# EAGLE design NanoConnectionBoard (EAGLE 9.0.1)
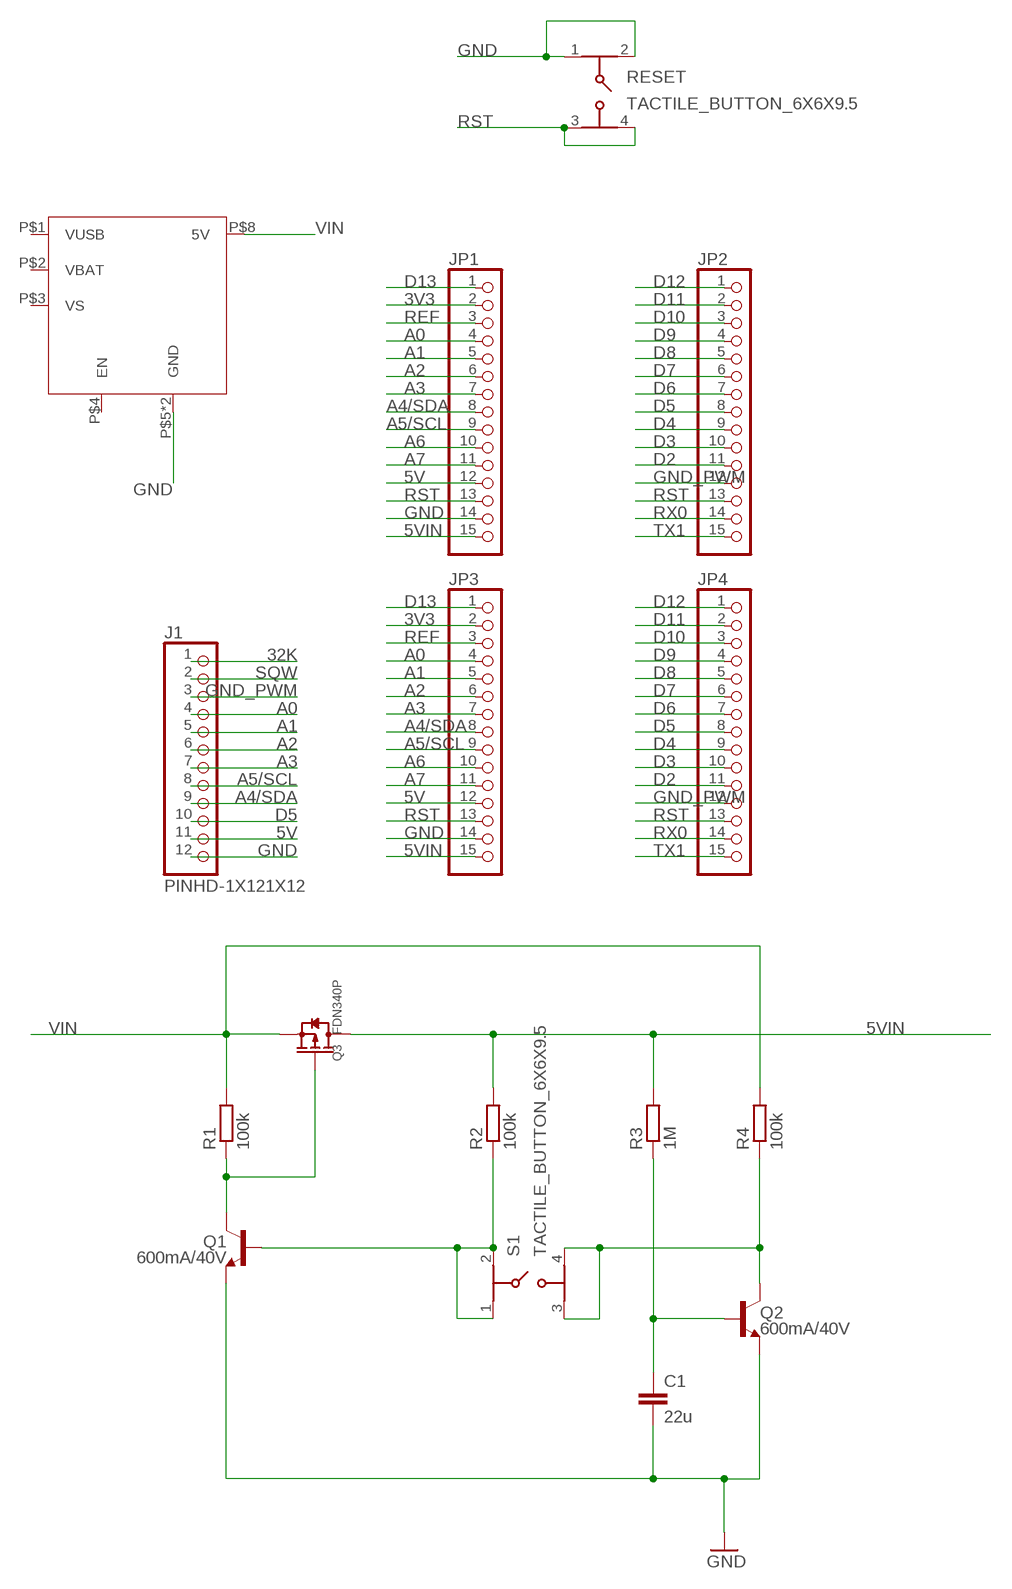
[diagram p0: schematic, sheet 1]

## Parts
C1  22u  C-EUC1210K  [C1210K]
J1  PINHD-1X121X12  [1X12]
JP1  PINHD-1X15-CB  [1X15-CB]
JP2  PINHD-1X15-CB  [1X15-CB]
JP3  PINHD-1X15-CB  [1X15-CB]
JP4  PINHD-1X15-CB  [1X15-CB]
Q1  600mA/40V  TRANS_NPN-P2N2222A  [TO-92]
Q2  600mA/40V  TRANS_NPN-P2N2222A  [TO-92]
Q3  FDN340P  SMD-MOSFET-P-CH-20V-2A-FDN340P(SOT-23)  [SOT-23]
R1  100k  R-EU_R0603  [R0603]
R2  100k  R-EU_R0603  [R0603]
R3  1M  R-EU_R0603  [R0603]
R4  100k  R-EU_R0603  [R0603]
RESET  TACTILE_BUTTON_6X6X9.5  [TACTILE_SWITCH_PTH_6.0MM]
S1  TACTILE_BUTTON_6X6X9.5  [TACTILE_SWITCH_PTH_6.0MM]
U$1  ADAFRUIT_POWERBOOST_1000C  [ADAFRUIT_POWERBOOST_1000C]

## Nets
3V3: JP1.2 JP3.2
5V: J1.11 JP1.12 JP3.12
5VIN: JP1.15 JP3.15 Q3.3(D) R2.2 R3.2
32K [Signal]: J1.1
A0 [Signal]: J1.4 JP1.4 JP3.4
A1 [Signal]: J1.5 JP1.5 JP3.5
A2 [Signal]: J1.6 JP1.6 JP3.6
A3: J1.7 JP1.7 JP3.7
A4/SDA: J1.9 JP1.8 JP3.8
A5/SCL: J1.8 JP1.9 JP3.9
A6: JP1.10 JP3.10
A7: JP1.11 JP3.11
D2: JP2.11 JP4.11
D3: JP2.10 JP4.10
D4: JP2.9 JP4.9
D5: J1.10 JP2.8 JP4.8
D6: JP2.7 JP4.7
D7: JP2.6 JP4.6
D8: JP2.5 JP4.5
D9: JP2.4 JP4.4
D10: JP2.3 JP4.3
D11: JP2.2 JP4.2
D12: JP2.1 JP4.1
D13: JP1.1 JP3.1
GND: C1.2 J1.12 JP1.14 JP3.14 Q1.3(E) Q2.3(E) RESET.1 RESET.2 U$1.P$5(GND) U$1.P$7(GND)
GND_PWM: J1.3 JP2.12 JP4.12
N$1: C1.1 Q2.2(B) R3.1
N$2: Q2.1(C) R4.1 S1.3 S1.4
N$3: Q1.1(C) Q3.1(G) R1.1
N$6: Q1.2(B) R2.1 S1.1 S1.2
REF: JP1.3 JP3.3
RST: JP1.13 JP2.13 JP3.13 JP4.13 RESET.3 RESET.4
RX0: JP2.14 JP4.14
SQW [Signal]: J1.2
TX1: JP2.15 JP4.15
VIN: Q3.2(S) R1.2 R4.2 U$1.P$8(5V)
Unconnected: U$1.P$4(EN)

## Power pins joined to a net without a drawn wire
VBAT: U$1.P$2(VBAT)
VS: U$1.P$3(VS)
VUSB: U$1.P$1(VUSB)

## Library data of the parts
C1 = resistor:C-EU: CAPACITOR, European symbol
J1 = Pat Sonstiges:PINHD-1X12
JP1-JP4 = adafruit:PINHD-1X15: PIN HEADER
Q1 Q2 = SparkFun-DiscreteSemi:TRANS_NPN: NPN transistor Current controlled devices typically used to amplify current or used as a switch. BC547 - COM-08928 <http://www.sparkfun.com/products/8928> (TO-92 45V 100mA) (1.Collector 2.Base 3.Emitter) 2N3904 - COM-00521 <http://www.sparkfun.com/products/521> (TO-92 40V 200mA) (1.Emitter 2.Base 3.Collector) P2N2222A - COM-12852 <http://www.sparkfun.com/products/12852> (TO-92 40V 600mA) (1.Collector 2.Base 3.Emitter); PROD_ID: TRANS-09536
Q3 = Seeed-Transistor:SMD-MOSFET-P-CH-20V-2A-FDN340P(SOT-23): 305030026; MPN: FDN340P
R1-R4 = rcl:R-EU_: RESISTOR, European symbol; SPICEPREFIX: R
RESET S1 = Pat Sonstiges:TACTILE_BUTTON_6X6X9.5
U$1 = My Breakout Boards:ADAFRUIT_POWERBOOST_1000C

## Net classes
0 default: width 0.254 mm, drill 0.8 mm, clearance 0.203 mm
1 Signal: width 0.254 mm, drill 0.8 mm, clearance 0.203 mm to class 0, clearance 0.203 mm

## Board
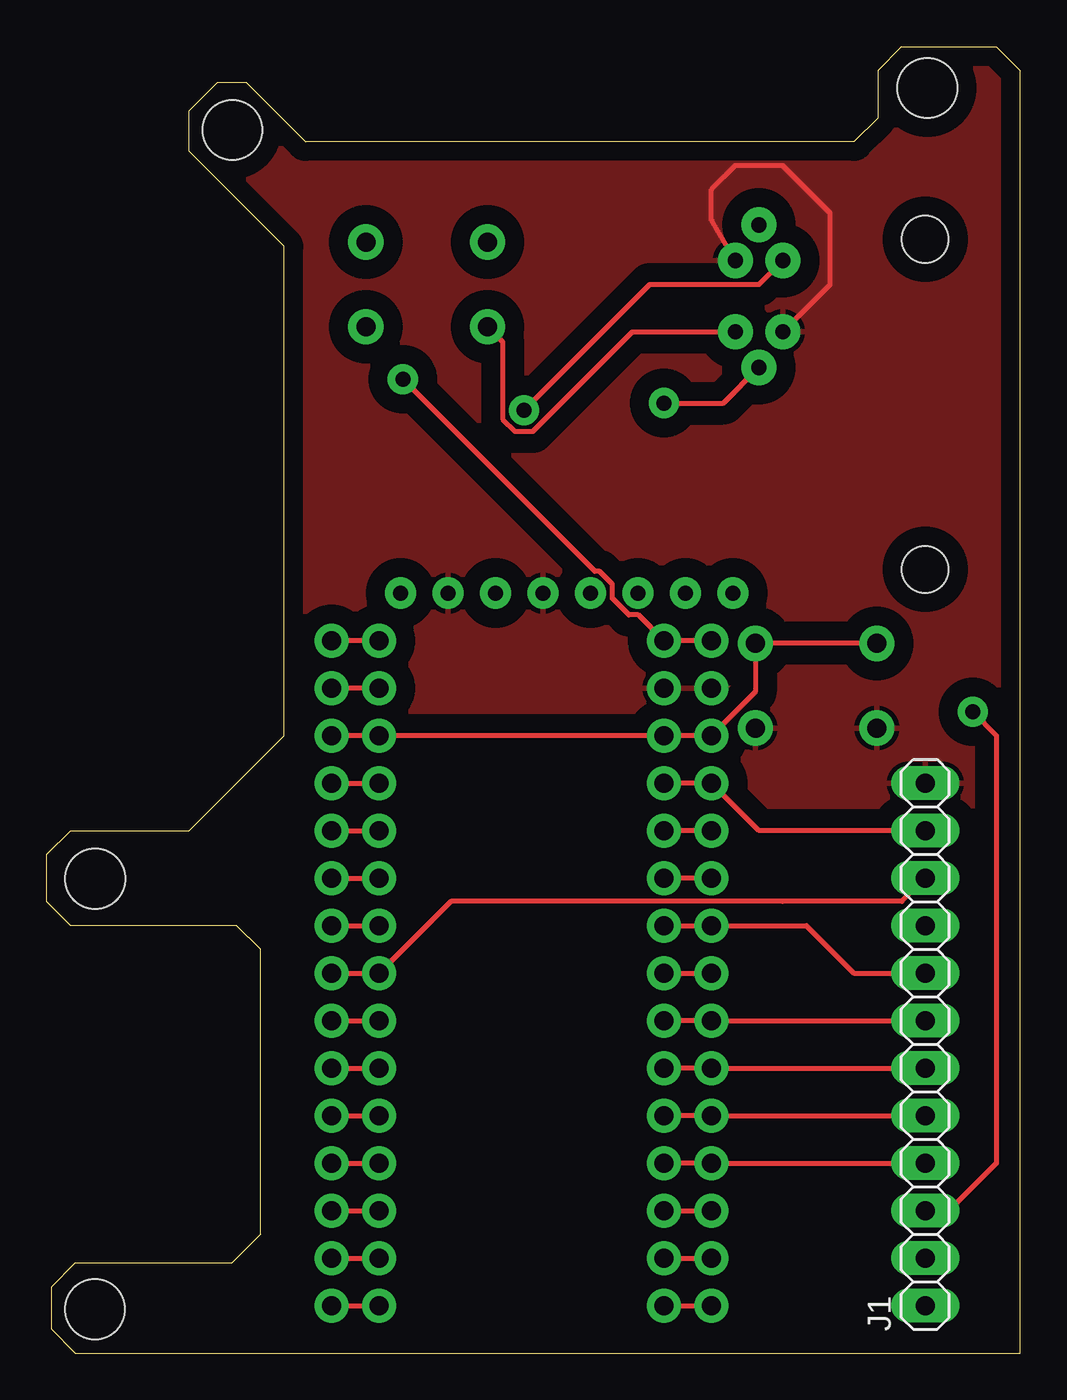
[diagram p1: board, top side]
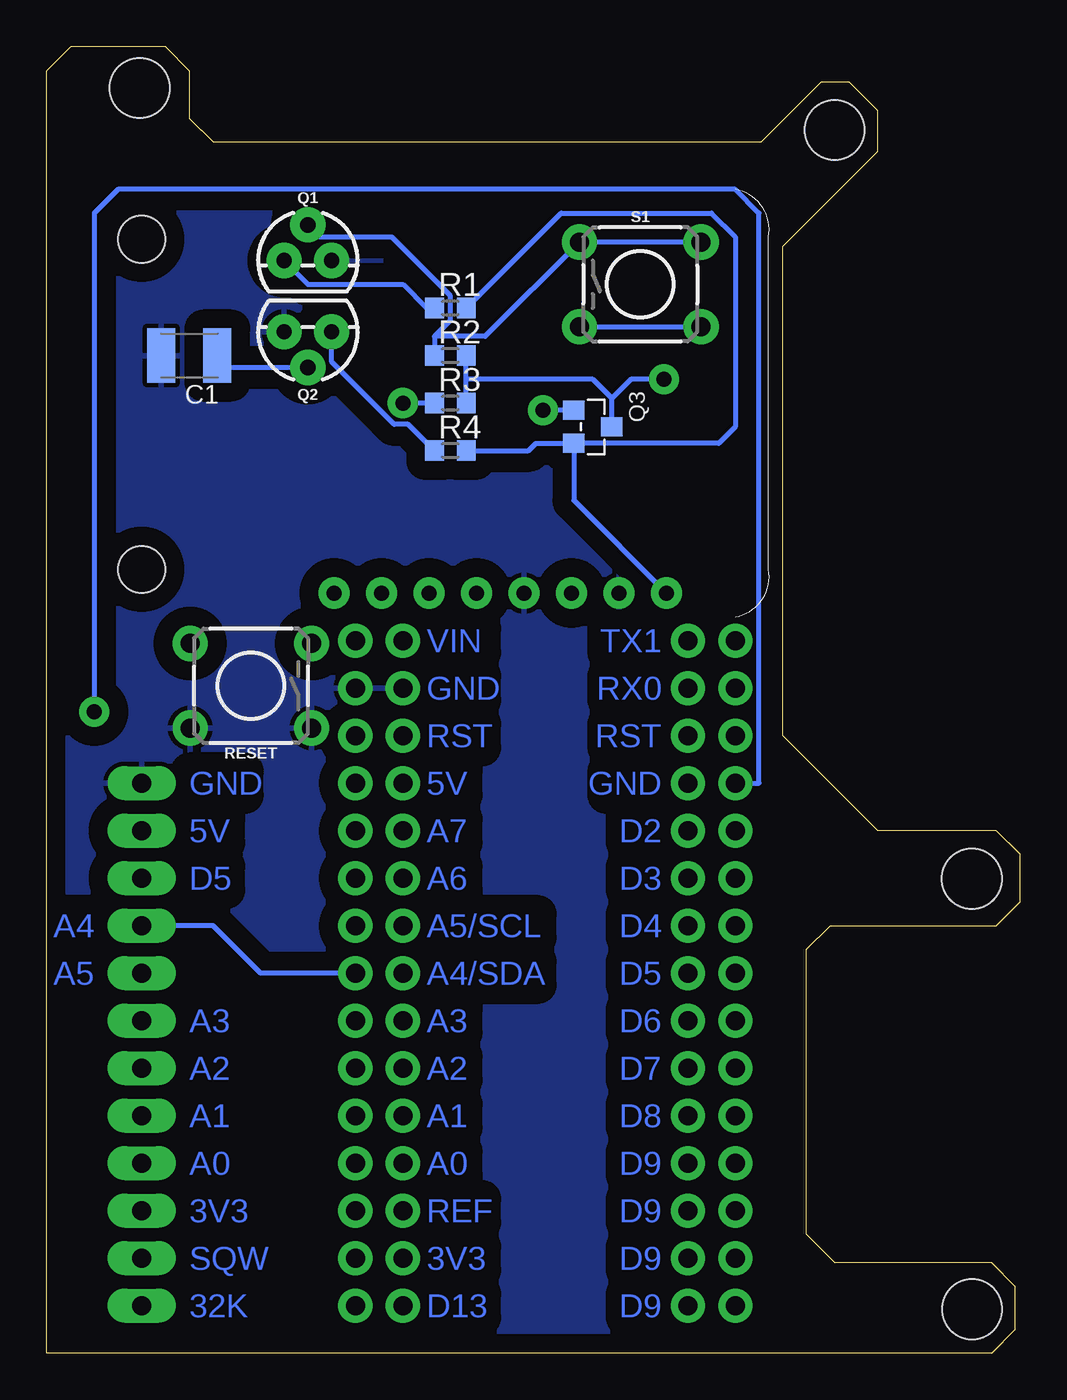
[diagram p2: board, bottom side, seen from below]

Size 52.07 x 69.85 mm. Coordinates in mm from the lower left corner, seen from the top.
Outline: 1.52,0 52.07,0 52.07,68.58 50.8,69.85 45.72,69.85 44.45,68.58 44.45,66.04 43.18,64.77 13.84,64.77 10.67,67.94 9.14,67.94 7.62,66.42 7.62,64.26 12.7,59.18 12.7,33.02 7.62,27.94 1.27,27.94 0,26.67 0,24.13 1.27,22.86 10.16,22.86 11.43,21.59 11.43,6.35 9.91,4.83 1.52,4.83 0.25,3.56 0.25,1.27 1.52,0
Copper layers (1*16): Top 0.035mm / dielectric 1.5mm / Bottom 0.035mm
Design rules "MakerSpace": minimum track width 8mil, minimum drill 0.6mm, track to track 8mil, track to pad 8mil, pad to pad 8mil, via to via 8mil, smd to smd 8mil, copper to edge 40mil, drill to drill 10mil, minimum pad ring 16mil, minimum via ring 16mil, stop-mask expansion 4mil, vias tented up to drill 0mil, thermal gap 10mil
Holes 3.2 mm at 47.1,67.64 9.93,65.41 2.59,25.37 2.58,2.36

### Footprints (pad centres in the part's own frame; a part is rotated, then mirrored left to right if it is on the bottom)
C1210K = smd 1.5 x 2.9: 1 -1.5,0; 2 1.5,0
1X12 = drill 1.016 long: 1 -13.97,0; 2 -11.43,0; 3 -8.89,0; 4 -6.35,0; 5 -3.81,0; 6 -1.27,0; 7 1.27,0; 8 3.81,0; 9 6.35,0; 10 8.89,0; 11 11.43,0; 12 13.97,0
1X15-CB = drill 1.016 pad 1.778: 1 -17.78,0; 2 -15.24,0; 3 -12.7,0; 4 -10.16,0; 5 -7.62,0; 6 -5.08,0; 7 -2.54,0; 8 0,0; 9 2.54,0; 10 5.08,0; 11 7.62,0; 12 10.16,0; 13 12.7,0; 14 15.24,0; 15 17.78,0
TO-92 = drill 0.813 pad 1.88: 1 -1.27,0; 2 0,1.905; 3 1.27,0
SOT-23 = smd 1.016 x 1.143: 1 -0.889,-1.016; 2 0.889,-1.016; 3 0,1.016
R0603 = smd 1 x 1.1: 1 -0.85,0; 2 0.85,0
TACTILE_SWITCH_PTH_6.0MM = drill 1.016 pad 1.88: 1 -3.251,2.261; 2 3.251,2.261; 3 -3.251,-2.261; 4 3.251,-2.261
ADAFRUIT_POWERBOOST_1000C = drill 0.8 pad 1.676: P$1 12.827,1.27; P$2 15.367,1.27; P$3 17.907,1.27; P$4 20.447,1.27; P$5 22.987,1.27; P$6 25.527,1.27; P$7 28.067,1.27; P$8 30.607,1.27 | hole 2.5: 2.54,20.19; 2.54,2.54

### Placement (x,y rotation side)
C1  44.45,53.34 180 bottom
J1  46.99,16.51 90 top
JP1  35.56,20.32 90 bottom
JP2  17.78,20.32 90 bottom
JP3  33.02,20.32 90 top
JP4  15.24,20.32 90 top
Q1  38.1,58.42 0 bottom
Q2  38.1,54.61 180 bottom
Q3  22.86,49.53 270 bottom
R1  30.48,55.88 0 bottom
R2  30.48,53.34 0 bottom
R3  30.48,50.8 0 bottom
R4  30.48,48.26 0 bottom
RESET  41.15,35.69 180 bottom
S1  20.32,57.15 0 bottom
U$1  49.53,39.37 0 bottom

### Tracks (layer width: path | path; a pad name or v marks a point on that pad's centre or on a via)
3V3
  Top 0.254: JP3.2 JP1.2
5V
  Top 0.254: JP3.12 JP1.12 38.1,27.94 J1.11 46.86,27.94
5VIN  (via drill 0.8)
  Top 0.254: JP1.15 JP3.15 31.65,39.47 31.14,39.47 30.25,40.36 30.25,41.12 29.57,41.81 29.31,41.81 v19.05,52.07
  Bottom 0.254: R3.2 29.63,52.07 | 29.63,52.07 R2.2 | Q3.3 21.84,51.05 | 21.84,51.05 22.86,52.07 29.63,52.07 | v19.05,52.07 20.83,52.07 21.84,51.05
A0
  Top 0.254: JP3.4 JP1.4 J1.4
A1
  Top 0.254: JP3.5 JP1.5 J1.5
A2
  Top 0.254: JP3.6 JP1.6 J1.6
A3
  Top 0.254: JP3.7 JP1.7 J1.7
A4/SDA
  Top 0.254: JP3.8 JP1.8
  Bottom 0.254: JP1.8 40.64,20.32 43.18,22.86 J1.9
A5/SCL
  Top 0.254: JP3.9 JP1.9 40.64,22.86 43.18,20.32 J1.8
A6
  Top 0.254: JP1.10 JP3.10
A7
  Top 0.254: JP1.11 JP3.11
D2
  Top 0.254: JP4.11 JP2.11
D3
  Top 0.254: JP4.10 JP2.10
D4
  Top 0.254: JP4.9 JP2.9
D5
  Top 0.254: JP4.8 JP2.8 21.62,24.16 39.37,24.16 45.75,24.16 J1.10
D6
  Top 0.254: JP4.7 JP2.7
D7
  Top 0.254: JP4.6 JP2.6
D8
  Top 0.254: JP4.5 JP2.5
D9
  Top 0.254: JP4.4 JP2.4
D10
  Top 0.254: JP4.3 JP2.3
D11
  Top 0.254: JP4.2 JP2.2
D12
  Top 0.254: JP4.1 JP2.1
D13
  Top 0.254: JP3.1 JP1.1
GND
  Top 0.254: 39.37,55.35 Q2.3 41.91,57.15 41.91,60.96 39.37,63.5 36.83,63.5 35.56,62.23 35.56,60.58 Q1.3
  pour Bottom (isolate 1.016): 52.07,71.12 52.07,-3.81 0,-3.81 0,71.12
  pour Top (isolate 1.016): 52.07,71.12 52.07,-3.81 0,-3.81 0,71.12
GND_PWM  (via drill 0.8)
  Top 0.254: JP4.12 JP2.12 | v49.53,34.29 50.8,33.02 50.8,10.16 48.26,7.62 J1.3
  Bottom 0.254: JP4.12 13.97,30.48 13.97,60.96 15.24,62.23 48.26,62.23 49.53,60.96 v49.53,34.29
N$1  (via drill 0.8)
  Top 0.254: v33.02,50.8 36.2,50.8 Q2.2
  Bottom 0.254: C1.1 42.31,52.7 Q2.2 | R3.1 v33.02,50.8
N$2
  Top 0.254: Q2.1 31.33,54.61 26,49.28 25.06,49.28 24.39,49.95 24.39,54.07 S1.3
  Bottom 0.254: S1.3 S1.4 | R4.1 32.73,49.66 33.49,49.66 36.83,53 Q2.1
N$3  (via drill 0.8)
  Top 0.254: v25.53,50.42 32.26,57.15 38.1,57.15 Q1.1
  Bottom 0.254: Q1.1 38.1,57.15 33.02,57.15 31.75,55.88 R1.1 | Q3.1 v25.53,50.42
N$6
  Bottom 0.254: S1.2 S1.1 28.62,54.36 31.33,54.36 | Q1.2 37.47,59.69 33.62,59.69 30.5,56.57 30.5,55.19 31.33,54.36 | 31.33,54.36 R2.1
REF
  Top 0.254: JP3.3 JP1.3
RST
  Top 0.254: JP4.13 JP2.13 JP3.13 JP1.13 37.9,35.36 RESET.3 RESET.4
RX0
  Top 0.254: JP2.14 JP4.14
TX1
  Top 0.254: JP2.15 JP4.15
VIN
  Bottom 0.254: Q3.2 25.91,48.64 26.29,48.26 R4.2 | R1.2 24.55,60.96 16.51,60.96 15.24,59.69 15.24,49.53 16.13,48.64 Q3.2 | U$1.P$8 23.88,45.59 Q3.2

### Text on the board
Bottom: TX1 | VIN | RX0 | GND | RST | RST | GND | 5V | GND | D2 | A7 | 5V | D3 | A6 | D5 | D4 | A5/SCL | A4 | D5 | A4/SDA | A5 | D6 | A3 | A3 | D7 | A2 | A2 | D8 | A1 | A1 | D9 | A0 | A0 | D9 | REF | 3V3 | D9 | 3V3 | SQW | D9 | D13 | 32K